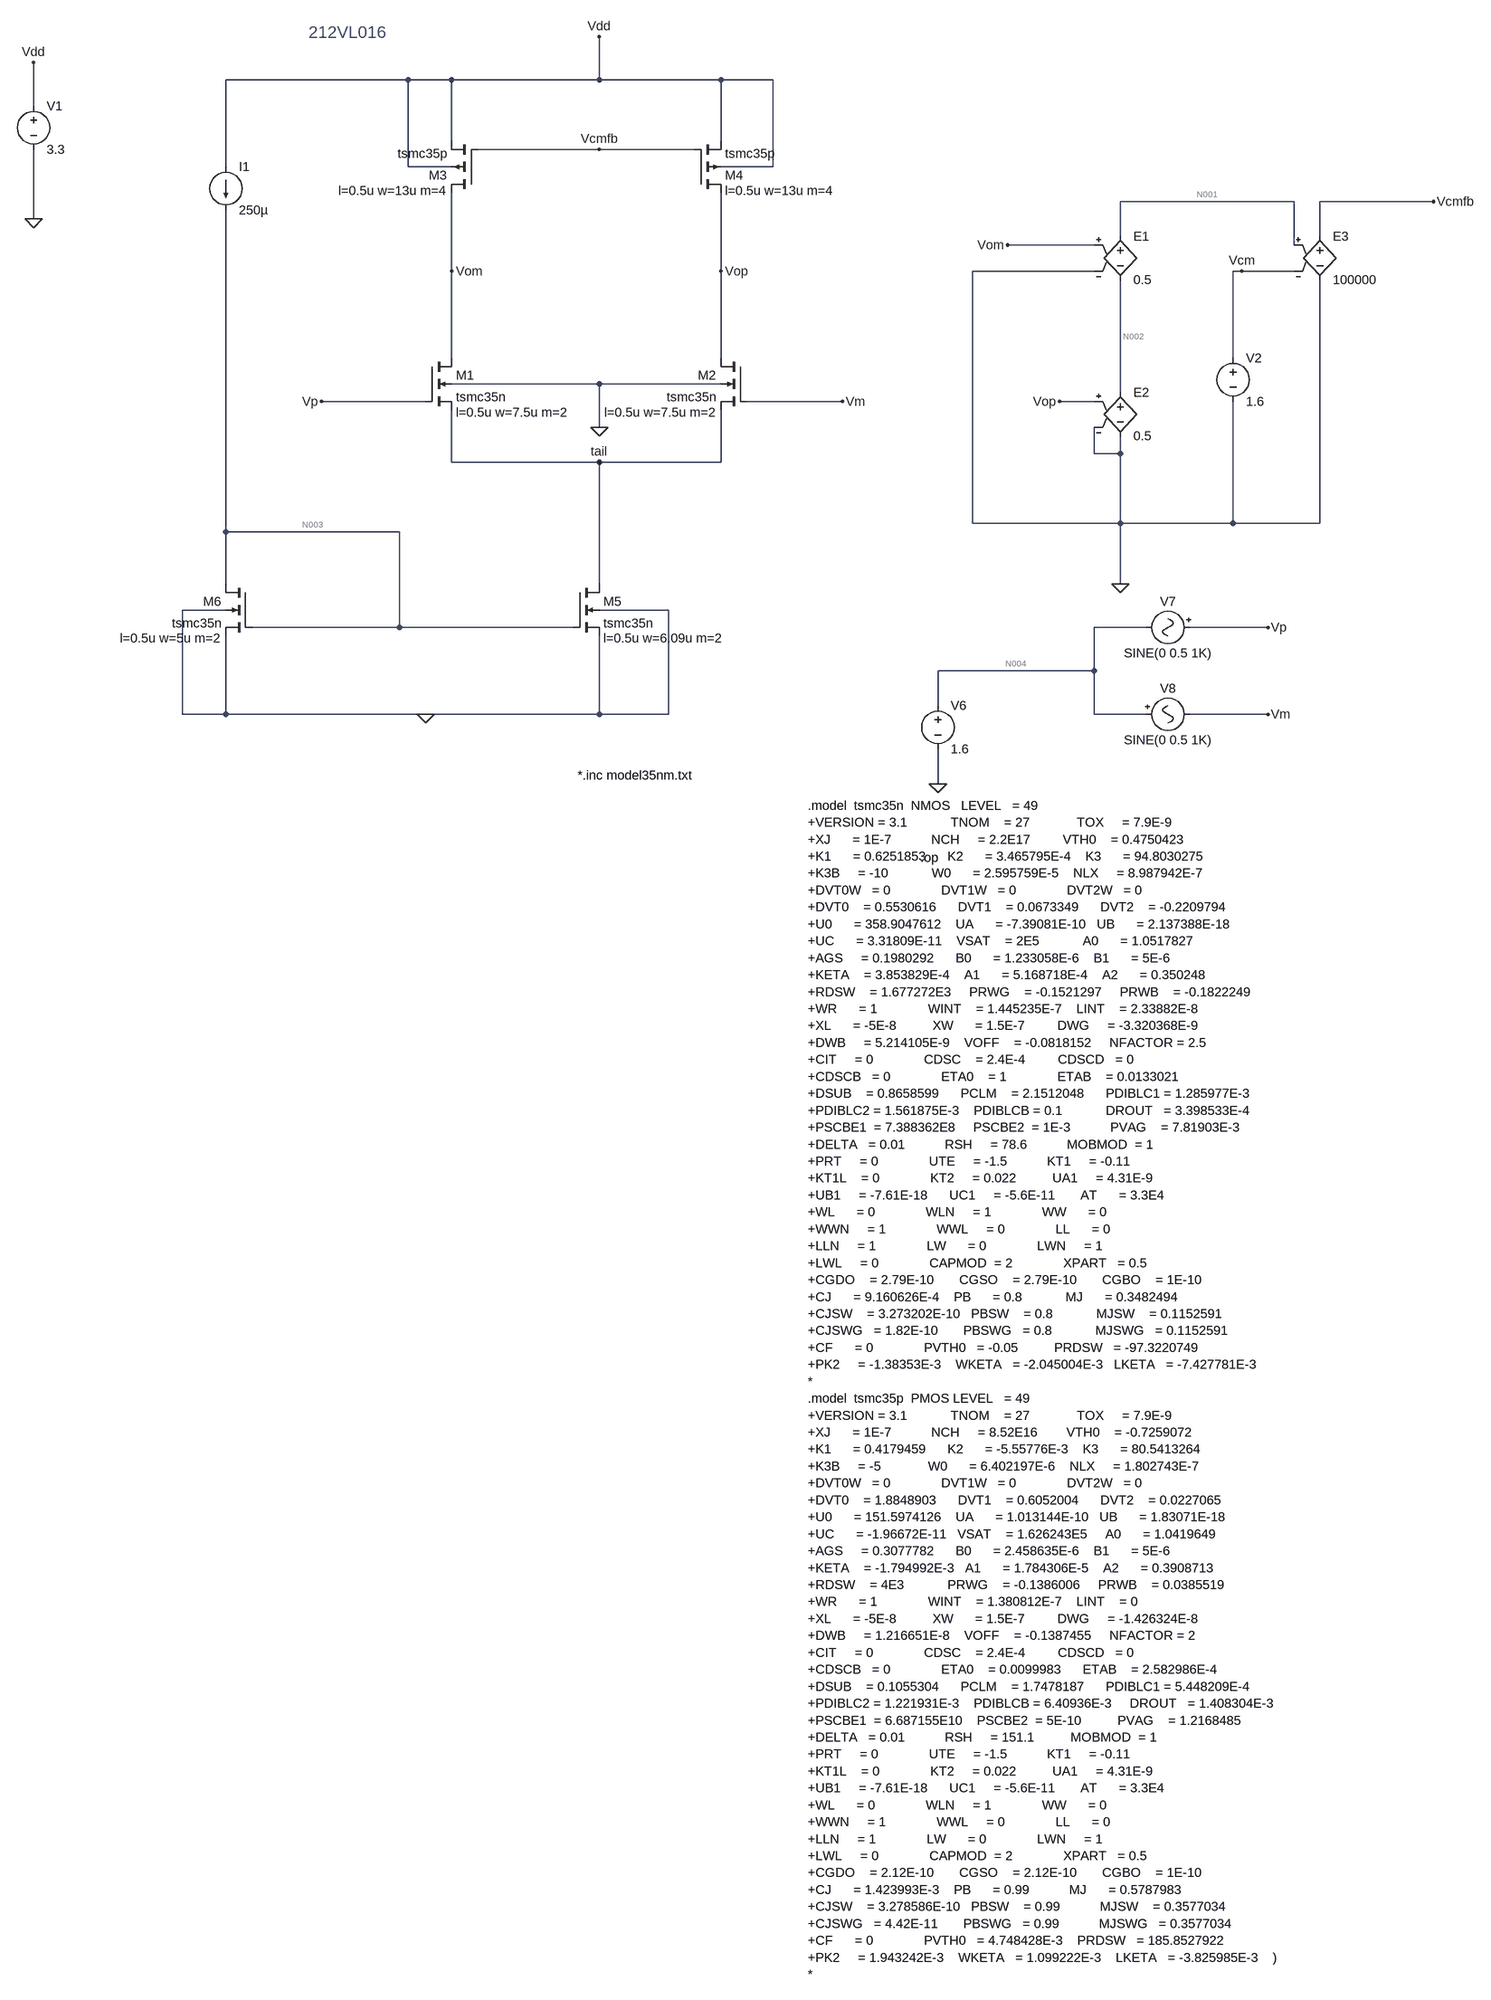
[diagram p0: schematic q3.asc]
q3.asc, the LTspice schematic file:
Version 4
SHEET 1 1788 2820
WIRE -240 -496 -576 -496
WIRE -160 -496 -240 -496
WIRE 112 -496 112 -576
WIRE 112 -496 -160 -496
WIRE 336 -496 112 -496
WIRE 432 -496 336 -496
WIRE -1072 -448 -1072 -528
WIRE -160 -384 -160 -496
WIRE 336 -384 336 -496
WIRE 112 -368 -112 -368
WIRE 288 -368 112 -368
WIRE -576 -336 -576 -496
WIRE -240 -336 -240 -496
WIRE -160 -336 -240 -336
WIRE 432 -336 432 -496
WIRE 432 -336 336 -336
WIRE 1392 -272 1072 -272
WIRE 1696 -272 1440 -272
WIRE -1072 -240 -1072 -368
WIRE 1072 -208 1072 -272
WIRE 1440 -208 1440 -272
WIRE 1024 -192 864 -192
WIRE 1392 -192 1392 -272
WIRE -160 -144 -160 -288
WIRE 336 -144 336 -288
WIRE 1024 -144 800 -144
WIRE 1296 -144 1280 -144
WIRE 1392 -144 1296 -144
WIRE -160 16 -160 -144
WIRE 336 16 336 -144
WIRE 1280 16 1280 -144
WIRE 112 64 -160 64
WIRE 336 64 112 64
WIRE 1072 80 1072 -128
WIRE -208 96 -400 96
WIRE 560 96 384 96
WIRE 1024 96 960 96
WIRE 112 144 112 64
WIRE 1024 192 1024 144
WIRE 1072 192 1072 160
WIRE 1072 192 1024 192
WIRE -160 208 -160 112
WIRE 112 208 -160 208
WIRE 336 208 336 112
WIRE 336 208 112 208
WIRE 800 352 800 -144
WIRE 1072 352 1072 192
WIRE 1072 352 800 352
WIRE 1280 352 1280 96
WIRE 1280 352 1072 352
WIRE 1440 352 1440 -128
WIRE 1440 352 1280 352
WIRE -576 368 -576 -256
WIRE -256 368 -576 368
WIRE -576 464 -576 368
WIRE 112 464 112 208
WIRE 1072 464 1072 352
WIRE -576 512 -656 512
WIRE 240 512 112 512
WIRE -256 544 -256 368
WIRE -256 544 -528 544
WIRE 64 544 -256 544
WIRE 1120 544 1024 544
WIRE 1344 544 1200 544
WIRE 1024 624 1024 544
WIRE 1024 624 736 624
WIRE 736 688 736 624
WIRE -656 704 -656 512
WIRE -576 704 -576 560
WIRE -576 704 -656 704
WIRE -208 704 -576 704
WIRE 112 704 112 560
WIRE 112 704 -208 704
WIRE 240 704 240 512
WIRE 240 704 112 704
WIRE 1024 704 1024 624
WIRE 1120 704 1024 704
WIRE 1344 704 1200 704
WIRE 736 832 736 768
FLAG 112 144 0
FLAG 112 -576 Vdd
FLAG 112 -368 Vcmfb
FLAG -160 -144 Vom
FLAG 336 -144 Vop
FLAG -1072 -528 Vdd
FLAG -1072 -240 0
FLAG 1072 464 0
FLAG 864 -192 Vom
FLAG 960 96 Vop
FLAG 1696 -272 Vcmfb
FLAG 1296 -144 Vcm
FLAG -400 96 Vp
FLAG 560 96 Vm
FLAG -208 704 0
FLAG 112 208 tail
FLAG 736 832 0
FLAG 1344 544 Vp
FLAG 1344 704 Vm
SYMBOL nmos4 -208 16 R0
WINDOW 123 56 100 Left 2
SYMATTR InstName M1
SYMATTR Value tsmc35n
SYMATTR Value2 l=0.5u w=7.5u m=2
SYMBOL nmos4 384 16 M0
WINDOW 123 56 100 Left 2
SYMATTR InstName M2
SYMATTR Value tsmc35n
SYMATTR Value2 l=0.5u w=7.5u m=2
SYMBOL pmos4 -112 -288 R180
WINDOW 123 56 4 Left 2
SYMATTR InstName M3
SYMATTR Value tsmc35p
SYMATTR Value2 l=0.5u w=13u m=4
SYMBOL pmos4 288 -288 M180
WINDOW 123 56 4 Left 2
SYMATTR InstName M4
SYMATTR Value tsmc35p
SYMATTR Value2 l=0.5u w=13u m=4
SYMBOL current -576 -336 R0
WINDOW 123 0 0 Left 0
WINDOW 39 0 0 Left 0
SYMATTR InstName I1
SYMATTR Value 250µ
SYMBOL voltage -1072 -464 R0
WINDOW 123 0 0 Left 0
WINDOW 39 0 0 Left 0
SYMATTR InstName V1
SYMATTR Value 3.3
SYMBOL e 1072 -224 R0
SYMATTR InstName E1
SYMATTR Value 0.5
SYMBOL e 1072 64 R0
SYMATTR InstName E2
SYMATTR Value 0.5
SYMBOL e 1440 -224 R0
SYMATTR InstName E3
SYMATTR Value 100000
SYMBOL voltage 1280 0 R0
WINDOW 123 0 0 Left 0
WINDOW 39 0 0 Left 0
SYMATTR InstName V2
SYMATTR Value 1.6
SYMBOL nmos4 64 464 R0
WINDOW 123 56 100 Left 2
SYMATTR InstName M5
SYMATTR Value tsmc35n
SYMATTR Value2 l=0.5u w=6.09u m=2
SYMBOL nmos4 -528 464 M0
WINDOW 123 56 100 Left 2
SYMATTR InstName M6
SYMATTR Value tsmc35n
SYMATTR Value2 l=0.5u w=5u m=2
SYMBOL voltage 736 672 R0
WINDOW 123 0 0 Left 0
WINDOW 39 0 0 Left 0
SYMATTR InstName V6
SYMATTR Value 1.6
SYMBOL Misc\\signal 1216 544 R90
WINDOW 0 -32 56 VBottom 2
WINDOW 3 32 56 VTop 2
WINDOW 123 0 0 Left 0
WINDOW 39 0 0 Left 0
SYMATTR InstName V7
SYMATTR Value SINE(0 0.5 1K)
SYMBOL Misc\\signal 1104 704 M90
WINDOW 0 -32 56 VBottom 2
WINDOW 3 32 56 VTop 2
WINDOW 123 0 0 Left 0
WINDOW 39 0 0 Left 0
SYMATTR InstName V8
SYMATTR Value SINE(0 0.5 1K)
TEXT 72 816 Left 2 !*.inc model35nm.txt
TEXT 496 872 Left 2 !.model  tsmc35n  NMOS   LEVEL   = 49\n+VERSION = 3.1            TNOM    = 27             TOX     = 7.9E-9\n+XJ      = 1E-7           NCH     = 2.2E17         VTH0    = 0.4750423\n+K1      = 0.6251853      K2      = 3.465795E-4    K3      = 94.8030275\n+K3B     = -10            W0      = 2.595759E-5    NLX     = 8.987942E-7\n+DVT0W   = 0              DVT1W   = 0              DVT2W   = 0\n+DVT0    = 0.5530616      DVT1    = 0.0673349      DVT2    = -0.2209794\n+U0      = 358.9047612    UA      = -7.39081E-10   UB      = 2.137388E-18\n+UC      = 3.31809E-11    VSAT    = 2E5            A0      = 1.0517827\n+AGS     = 0.1980292      B0      = 1.233058E-6    B1      = 5E-6\n+KETA    = 3.853829E-4    A1      = 5.168718E-4    A2      = 0.350248\n+RDSW    = 1.677272E3     PRWG    = -0.1521297     PRWB    = -0.1822249\n+WR      = 1              WINT    = 1.445235E-7    LINT    = 2.33882E-8\n+XL      = -5E-8          XW      = 1.5E-7         DWG     = -3.320368E-9\n+DWB     = 5.214105E-9    VOFF    = -0.0818152     NFACTOR = 2.5\n+CIT     = 0              CDSC    = 2.4E-4         CDSCD   = 0\n+CDSCB   = 0              ETA0    = 1              ETAB    = 0.0133021\n+DSUB    = 0.8658599      PCLM    = 2.1512048      PDIBLC1 = 1.285977E-3\n+PDIBLC2 = 1.561875E-3    PDIBLCB = 0.1            DROUT   = 3.398533E-4\n+PSCBE1  = 7.388362E8     PSCBE2  = 1E-3           PVAG    = 7.81903E-3\n+DELTA   = 0.01           RSH     = 78.6           MOBMOD  = 1\n+PRT     = 0              UTE     = -1.5           KT1     = -0.11\n+KT1L    = 0              KT2     = 0.022          UA1     = 4.31E-9\n+UB1     = -7.61E-18      UC1     = -5.6E-11       AT      = 3.3E4\n+WL      = 0              WLN     = 1              WW      = 0\n+WWN     = 1              WWL     = 0              LL      = 0\n+LLN     = 1              LW      = 0              LWN     = 1\n+LWL     = 0              CAPMOD  = 2              XPART   = 0.5\n+CGDO    = 2.79E-10       CGSO    = 2.79E-10       CGBO    = 1E-10\n+CJ      = 9.160626E-4    PB      = 0.8            MJ      = 0.3482494\n+CJSW    = 3.273202E-10   PBSW    = 0.8            MJSW    = 0.1152591\n+CJSWG   = 1.82E-10       PBSWG   = 0.8            MJSWG   = 0.1152591\n+CF      = 0              PVTH0   = -0.05          PRDSW   = -97.3220749\n+PK2     = -1.38353E-3    WKETA   = -2.045004E-3   LKETA   = -7.427781E-3    \n*\n.model  tsmc35p  PMOS LEVEL   = 49 \n+VERSION = 3.1            TNOM    = 27             TOX     = 7.9E-9\n+XJ      = 1E-7           NCH     = 8.52E16        VTH0    = -0.7259072\n+K1      = 0.4179459      K2      = -5.55776E-3    K3      = 80.5413264\n+K3B     = -5             W0      = 6.402197E-6    NLX     = 1.802743E-7\n+DVT0W   = 0              DVT1W   = 0              DVT2W   = 0\n+DVT0    = 1.8848903      DVT1    = 0.6052004      DVT2    = 0.0227065\n+U0      = 151.5974126    UA      = 1.013144E-10   UB      = 1.83071E-18\n+UC      = -1.96672E-11   VSAT    = 1.626243E5     A0      = 1.0419649\n+AGS     = 0.3077782      B0      = 2.458635E-6    B1      = 5E-6\n+KETA    = -1.794992E-3   A1      = 1.784306E-5    A2      = 0.3908713\n+RDSW    = 4E3            PRWG    = -0.1386006     PRWB    = 0.0385519\n+WR      = 1              WINT    = 1.380812E-7    LINT    = 0\n+XL      = -5E-8          XW      = 1.5E-7         DWG     = -1.426324E-8\n+DWB     = 1.216651E-8    VOFF    = -0.1387455     NFACTOR = 2\n+CIT     = 0              CDSC    = 2.4E-4         CDSCD   = 0\n+CDSCB   = 0              ETA0    = 0.0099983      ETAB    = 2.582986E-4\n+DSUB    = 0.1055304      PCLM    = 1.7478187      PDIBLC1 = 5.448209E-4\n+PDIBLC2 = 1.221931E-3    PDIBLCB = 6.40936E-3     DROUT   = 1.408304E-3\n+PSCBE1  = 6.687155E10    PSCBE2  = 5E-10          PVAG    = 1.2168485\n+DELTA   = 0.01           RSH     = 151.1          MOBMOD  = 1\n+PRT     = 0              UTE     = -1.5           KT1     = -0.11\n+KT1L    = 0              KT2     = 0.022          UA1     = 4.31E-9\n+UB1     = -7.61E-18      UC1     = -5.6E-11       AT      = 3.3E4\n+WL      = 0              WLN     = 1              WW      = 0\n+WWN     = 1              WWL     = 0              LL      = 0\n+LLN     = 1              LW      = 0              LWN     = 1\n+LWL     = 0              CAPMOD  = 2              XPART   = 0.5\n+CGDO    = 2.12E-10       CGSO    = 2.12E-10       CGBO    = 1E-10\n+CJ      = 1.423993E-3    PB      = 0.99           MJ      = 0.5787983\n+CJSW    = 3.278586E-10   PBSW    = 0.99           MJSW    = 0.3577034\n+CJSWG   = 4.42E-11       PBSWG   = 0.99           MJSWG   = 0.3577034\n+CF      = 0              PVTH0   = 4.748428E-3    PRDSW   = 185.8527922\n+PK2     = 1.943242E-3    WKETA   = 1.099222E-3    LKETA   = -3.825985E-3    )\n*
TEXT -424 -584 Left 3 ;212VL016
TEXT 704 968 Left 2 !.op

The netlist it stands for:
* q3.asc
M1 Vom Vp tail 0 tsmc35n l=0.5u w=7.5u m=2
M2 Vop Vm tail 0 tsmc35n l=0.5u w=7.5u m=2
M3 Vom Vcmfb Vdd Vdd tsmc35p l=0.5u w=13u m=4
M4 Vop Vcmfb Vdd Vdd tsmc35p l=0.5u w=13u m=4
I1 Vdd N003 250µ
V1 Vdd 0 3.3
E1 N001 N002 Vom 0 0.5
E2 N002 0 Vop 0 0.5
E3 Vcmfb 0 N001 Vcm 100000
V2 Vcm 0 1.6
M5 tail N003 0 0 tsmc35n l=0.5u w=6.09u m=2
M6 N003 N003 0 0 tsmc35n l=0.5u w=5u m=2
V6 N004 0 1.6
V7 Vp N004 SINE(0 0.5 1K)
V8 N004 Vm SINE(0 0.5 1K)
.model NMOS NMOS
.model PMOS PMOS
.lib standard.mos
*.inc model35nm.txt
.model  tsmc35n  NMOS   LEVEL   = 49
+VERSION = 3.1            TNOM    = 27             TOX     = 7.9E-9
+XJ      = 1E-7           NCH     = 2.2E17         VTH0    = 0.4750423
+K1      = 0.6251853      K2      = 3.465795E-4    K3      = 94.8030275
+K3B     = -10            W0      = 2.595759E-5    NLX     = 8.987942E-7
+DVT0W   = 0              DVT1W   = 0              DVT2W   = 0
+DVT0    = 0.5530616      DVT1    = 0.0673349      DVT2    = -0.2209794
+U0      = 358.9047612    UA      = -7.39081E-10   UB      = 2.137388E-18
+UC      = 3.31809E-11    VSAT    = 2E5            A0      = 1.0517827
+AGS     = 0.1980292      B0      = 1.233058E-6    B1      = 5E-6
+KETA    = 3.853829E-4    A1      = 5.168718E-4    A2      = 0.350248
+RDSW    = 1.677272E3     PRWG    = -0.1521297     PRWB    = -0.1822249
+WR      = 1              WINT    = 1.445235E-7    LINT    = 2.33882E-8
+XL      = -5E-8          XW      = 1.5E-7         DWG     = -3.320368E-9
+DWB     = 5.214105E-9    VOFF    = -0.0818152     NFACTOR = 2.5
+CIT     = 0              CDSC    = 2.4E-4         CDSCD   = 0
+CDSCB   = 0              ETA0    = 1              ETAB    = 0.0133021
+DSUB    = 0.8658599      PCLM    = 2.1512048      PDIBLC1 = 1.285977E-3
+PDIBLC2 = 1.561875E-3    PDIBLCB = 0.1            DROUT   = 3.398533E-4
+PSCBE1  = 7.388362E8     PSCBE2  = 1E-3           PVAG    = 7.81903E-3
+DELTA   = 0.01           RSH     = 78.6           MOBMOD  = 1
+PRT     = 0              UTE     = -1.5           KT1     = -0.11
+KT1L    = 0              KT2     = 0.022          UA1     = 4.31E-9
+UB1     = -7.61E-18      UC1     = -5.6E-11       AT      = 3.3E4
+WL      = 0              WLN     = 1              WW      = 0
+WWN     = 1              WWL     = 0              LL      = 0
+LLN     = 1              LW      = 0              LWN     = 1
+LWL     = 0              CAPMOD  = 2              XPART   = 0.5
+CGDO    = 2.79E-10       CGSO    = 2.79E-10       CGBO    = 1E-10
+CJ      = 9.160626E-4    PB      = 0.8            MJ      = 0.3482494
+CJSW    = 3.273202E-10   PBSW    = 0.8            MJSW    = 0.1152591
+CJSWG   = 1.82E-10       PBSWG   = 0.8            MJSWG   = 0.1152591
+CF      = 0              PVTH0   = -0.05          PRDSW   = -97.3220749
+PK2     = -1.38353E-3    WKETA   = -2.045004E-3   LKETA   = -7.427781E-3
*
.model  tsmc35p  PMOS LEVEL   = 49
+VERSION = 3.1            TNOM    = 27             TOX     = 7.9E-9
+XJ      = 1E-7           NCH     = 8.52E16        VTH0    = -0.7259072
+K1      = 0.4179459      K2      = -5.55776E-3    K3      = 80.5413264
+K3B     = -5             W0      = 6.402197E-6    NLX     = 1.802743E-7
+DVT0W   = 0              DVT1W   = 0              DVT2W   = 0
+DVT0    = 1.8848903      DVT1    = 0.6052004      DVT2    = 0.0227065
+U0      = 151.5974126    UA      = 1.013144E-10   UB      = 1.83071E-18
+UC      = -1.96672E-11   VSAT    = 1.626243E5     A0      = 1.0419649
+AGS     = 0.3077782      B0      = 2.458635E-6    B1      = 5E-6
+KETA    = -1.794992E-3   A1      = 1.784306E-5    A2      = 0.3908713
+RDSW    = 4E3            PRWG    = -0.1386006     PRWB    = 0.0385519
+WR      = 1              WINT    = 1.380812E-7    LINT    = 0
+XL      = -5E-8          XW      = 1.5E-7         DWG     = -1.426324E-8
+DWB     = 1.216651E-8    VOFF    = -0.1387455     NFACTOR = 2
+CIT     = 0              CDSC    = 2.4E-4         CDSCD   = 0
+CDSCB   = 0              ETA0    = 0.0099983      ETAB    = 2.582986E-4
+DSUB    = 0.1055304      PCLM    = 1.7478187      PDIBLC1 = 5.448209E-4
+PDIBLC2 = 1.221931E-3    PDIBLCB = 6.40936E-3     DROUT   = 1.408304E-3
+PSCBE1  = 6.687155E10    PSCBE2  = 5E-10          PVAG    = 1.2168485
+DELTA   = 0.01           RSH     = 151.1          MOBMOD  = 1
+PRT     = 0              UTE     = -1.5           KT1     = -0.11
+KT1L    = 0              KT2     = 0.022          UA1     = 4.31E-9
+UB1     = -7.61E-18      UC1     = -5.6E-11       AT      = 3.3E4
+WL      = 0              WLN     = 1              WW      = 0
+WWN     = 1              WWL     = 0              LL      = 0
+LLN     = 1              LW      = 0              LWN     = 1
+LWL     = 0              CAPMOD  = 2              XPART   = 0.5
+CGDO    = 2.12E-10       CGSO    = 2.12E-10       CGBO    = 1E-10
+CJ      = 1.423993E-3    PB      = 0.99           MJ      = 0.5787983
+CJSW    = 3.278586E-10   PBSW    = 0.99           MJSW    = 0.3577034
+CJSWG   = 4.42E-11       PBSWG   = 0.99           MJSWG   = 0.3577034
+CF      = 0              PVTH0   = 4.748428E-3    PRDSW   = 185.8527922
+PK2     = 1.943242E-3    WKETA   = 1.099222E-3    LKETA   = -3.825985E-3    )
*
* 212VL016
.op
.backanno
.end

* Results of the author's LTspice run, read from the files saved beside the schematic
* Operating Point:
*   V(vom) = 1.6 V
*   V(vp) = 1.6 V
*   V(tail) = 485 mV
*   V(vop) = 1.6 V
*   V(vm) = 1.6 V
*   V(vcmfb) = 2.33 V
*   V(vdd) = 3.3 V
*   V(n003) = 1.168 V
*   V(n001) = 1.6 V
*   V(n002) = 800 mV
*   V(vcm) = 1.6 V
*   V(n004) = 1.6 V
*   Id(M4) = -136.5 µA
*   Ig(M4) = 0 A
*   Ib(M4) = 6.84 pA
*   Is(M4) = 136.5 µA
*   Id(M3) = -136.5 µA
*   Ig(M3) = 0 A
*   Ib(M3) = 6.84 pA
*   Is(M3) = 136.5 µA
*   Id(M6) = 250 µA
*   Ig(M6) = 0 A
*   Ib(M6) = -2.355 pA
*   Is(M6) = -250 µA
*   Id(M5) = 273.1 µA
*   Ig(M5) = 0 A
*   Ib(M5) = -990 fA
*   Is(M5) = -273.1 µA
*   Id(M2) = 136.5 µA
*   Ig(M2) = 0 A
*   Ib(M2) = -4.21 pA
*   Is(M2) = -136.5 µA
*   Id(M1) = 136.5 µA
*   Ig(M1) = 0 A
*   Ib(M1) = -4.21 pA
*   Is(M1) = -136.5 µA
*   I(I1) = 250 µA
*   I(E3) = 0 A
*   I(E2) = 0 A
*   I(E1) = 0 A
*   I(V8) = 0 A
*   I(V7) = 0 A
*   I(V6) = 0 A
*   I(V2) = 0 A
*   I(V1) = -523.1 µA
* From the log:
*   Semiconductor Device Operating Points:
*                           --- BSIM3 MOSFETS ---
*   Name:        m4          m3          m6          m5          m2
*   Model:     tsmc35p     tsmc35p     tsmc35n     tsmc35n     tsmc35n
*   Id:       -1.37e-04   -1.37e-04    2.50e-04    2.73e-04    1.37e-04
*   Vgs:      -9.70e-01   -9.70e-01    1.17e+00    1.17e+00    1.12e+00
*   Vds:      -1.70e+00   -1.70e+00    1.17e+00    4.85e-01    1.12e+00
*   Vbs:       0.00e+00    0.00e+00    0.00e+00    0.00e+00   -4.85e-01
*   Vth:      -7.72e-01   -7.72e-01    7.40e-01    7.49e-01    8.76e-01
*   Vdsat:    -2.00e-01   -2.00e-01    3.00e-01    2.95e-01    1.96e-01
*   Gm:        1.13e-03    1.13e-03    1.07e-03    1.17e-03    1.14e-03
*   Gds:       1.93e-05    1.93e-05    2.20e-05    9.59e-05    1.76e-05
*   Gmb        2.27e-04    2.27e-04    2.65e-04    2.90e-04    2.51e-04
*   Cbd:       0.00e+00    0.00e+00    0.00e+00    0.00e+00    0.00e+00
*   Cbs:       0.00e+00    0.00e+00    0.00e+00    0.00e+00    0.00e+00
*   Cgsov:     1.08e-14    1.08e-14    2.63e-15    3.24e-15    4.02e-15
*   Cgdov:     1.08e-14    1.08e-14    2.63e-15    3.24e-15    4.02e-15
*   Cgbov:     2.00e-16    2.00e-16    9.06e-17    9.06e-17    9.06e-17
*   dQgdVgb:   1.11e-13    1.11e-13    2.07e-14    2.55e-14    3.11e-14
*   dQgdVdb:  -9.91e-15   -9.91e-15   -2.54e-15   -3.22e-15   -3.88e-15
*   dQgdVsb:  -9.39e-14   -9.39e-14   -1.66e-14   -2.05e-14   -2.52e-14
*   dQddVgb:  -4.77e-14   -4.77e-14   -8.85e-15   -1.10e-14   -1.35e-14
*   dQddVdb:   1.03e-14    1.03e-14    2.58e-15    3.26e-15    3.95e-15
*   dQddVsb:   4.52e-14    4.52e-14    8.12e-15    1.00e-14    1.19e-14
*   dQbdVgb:  -1.53e-14   -1.53e-14   -2.96e-15   -3.54e-15   -4.11e-15
*   dQbdVdb:   8.23e-17    8.23e-17    1.40e-17   -6.02e-17    1.66e-17
*   dQbdVsb:  -7.23e-15   -7.23e-15   -2.24e-15   -2.78e-15   -2.55e-15
*   Name:        m1
*   Model:     tsmc35n
*   Id:        1.37e-04
*   Vgs:       1.12e+00
*   Vds:       1.12e+00
*   Vbs:      -4.85e-01
*   Vth:       8.76e-01
*   Vdsat:     1.96e-01
*   Gm:        1.14e-03
*   Gds:       1.76e-05
*   Gmb        2.51e-04
*   Cbd:       0.00e+00
*   Cbs:       0.00e+00
*   Cgsov:     4.02e-15
*   Cgdov:     4.02e-15
*   Cgbov:     9.06e-17
*   dQgdVgb:   3.11e-14
*   dQgdVdb:  -3.88e-15
*   dQgdVsb:  -2.52e-14
*   dQddVgb:  -1.35e-14
*   dQddVdb:   3.95e-15
*   dQddVsb:   1.19e-14
*   dQbdVgb:  -4.11e-15
*   dQbdVdb:   1.66e-17
*   dQbdVsb:  -2.55e-15